# Altium schematic sheet MB-01-TopLevel.SchDoc
size A3
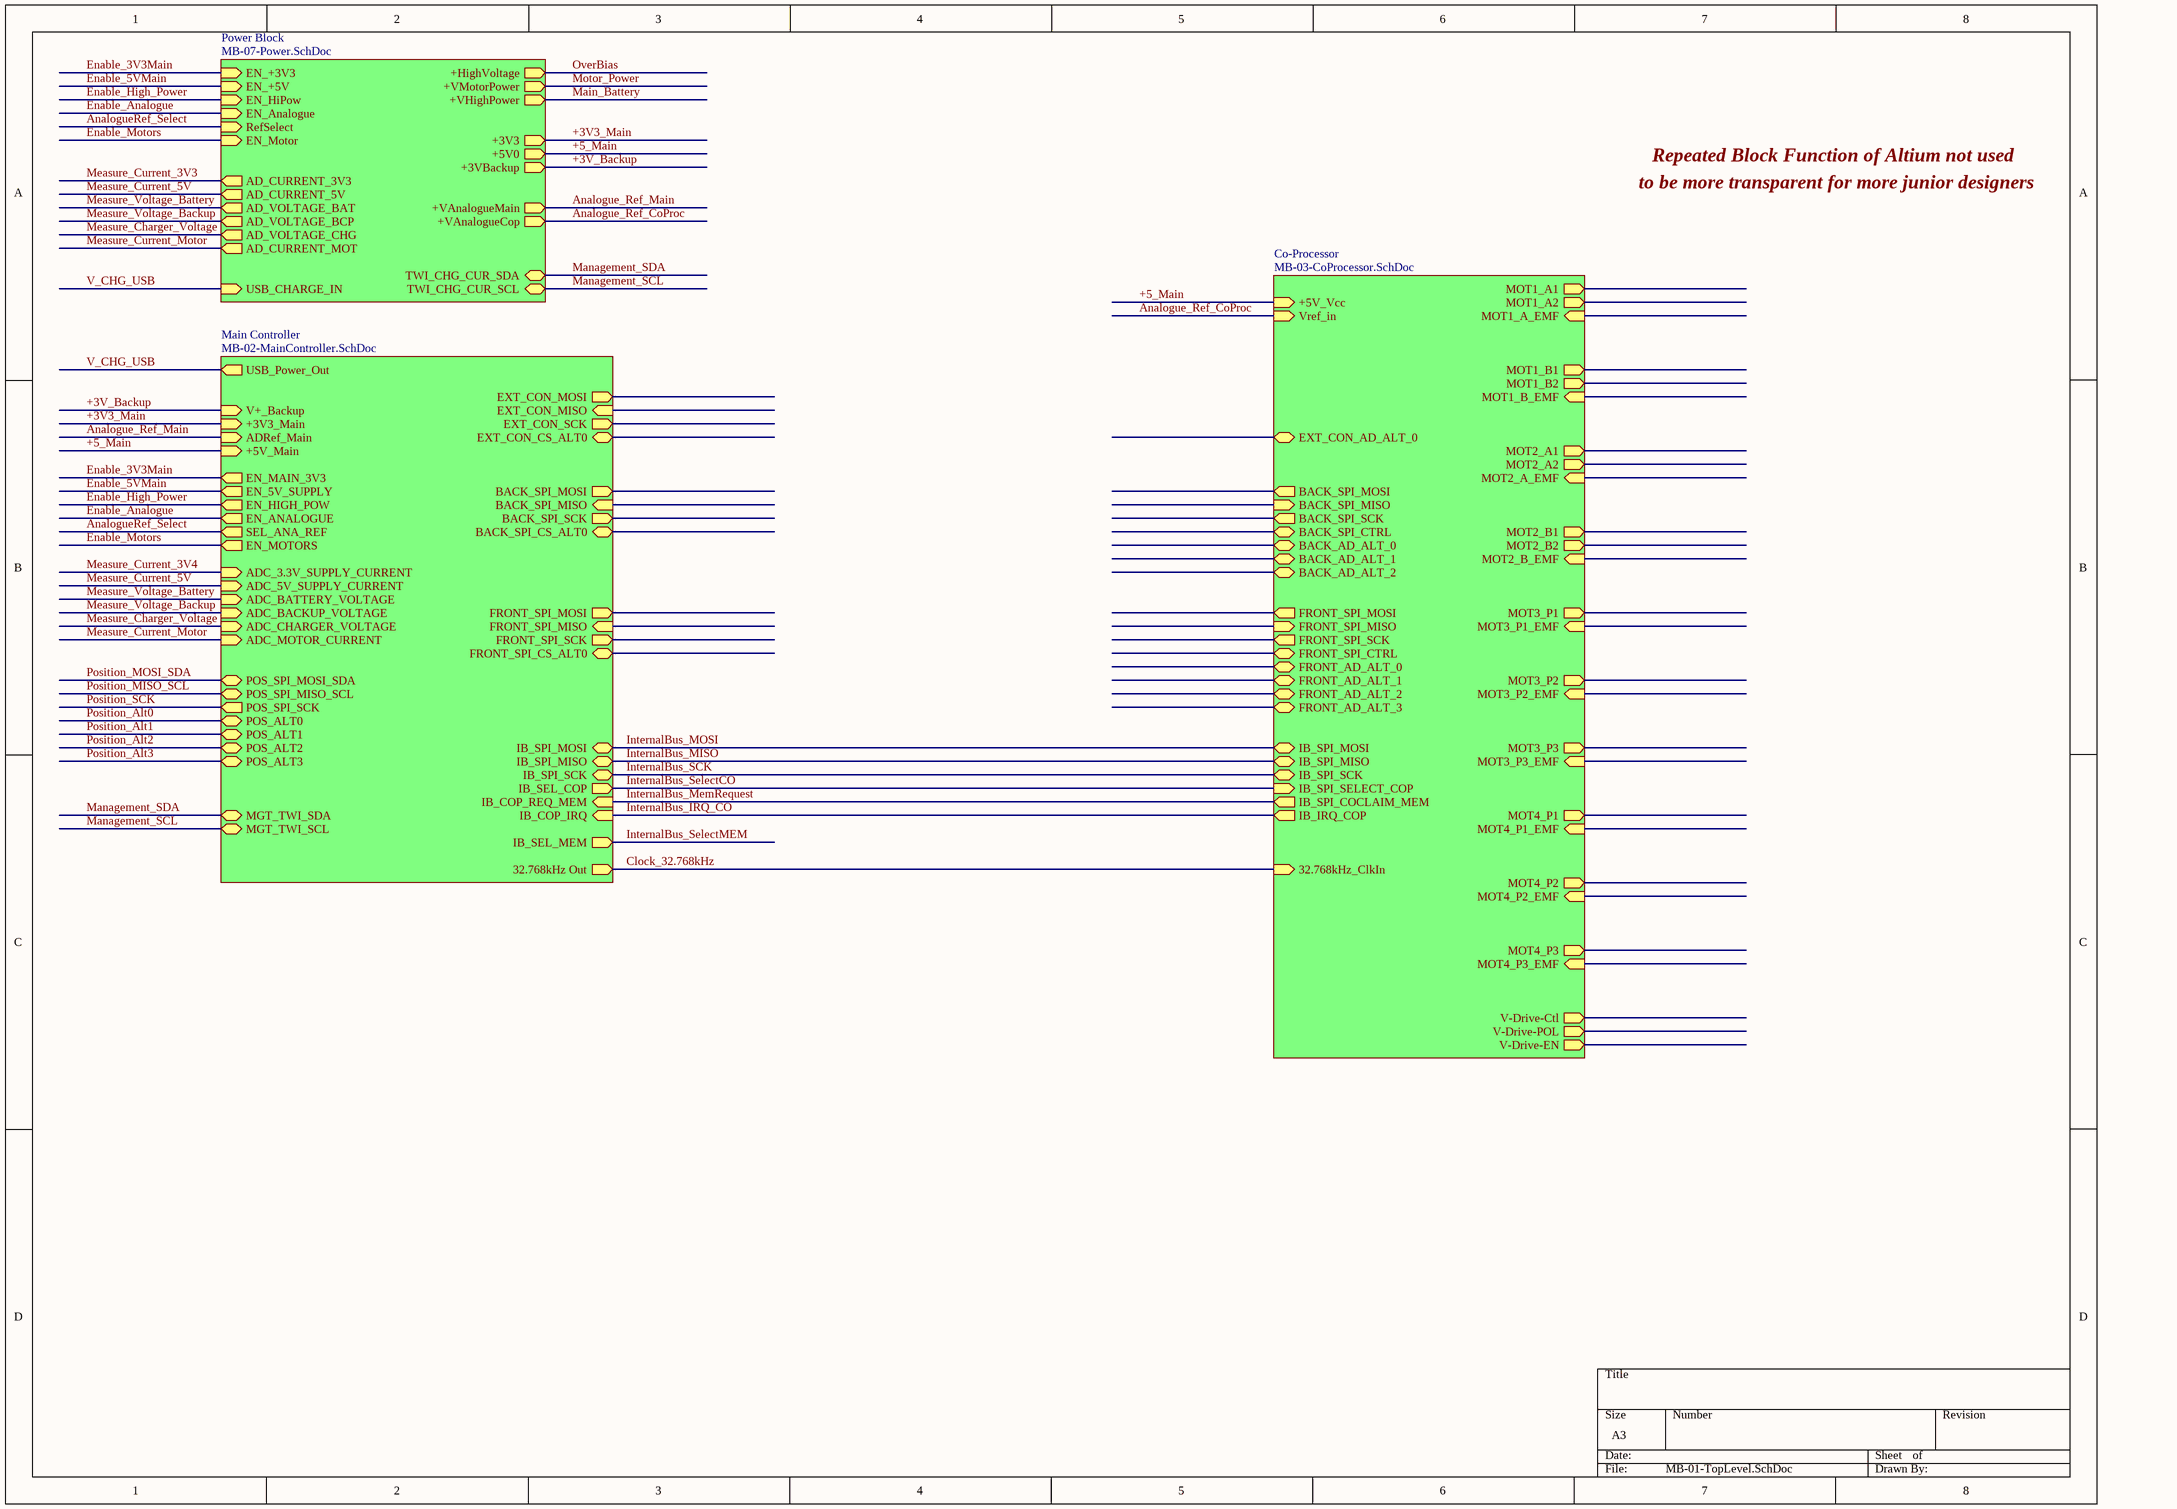
[diagram p0: MB-01-TopLevel.SchDoc]

## Sub-sheets
Co-Processor = MB-03-CoProcessor.SchDoc: BACK_AD_ALT_1 (bidir), EXT_CON_AD_ALT_0 (bidir), BACK_AD_ALT_2 (bidir), BACK_AD_ALT_0 (bidir), FRONT_AD_ALT_3 (bidir), FRONT_AD_ALT_2 (bidir), FRONT_AD_ALT_1 (bidir), FRONT_AD_ALT_0 (bidir), BACK_SPI_SCK (out), BACK_SPI_MISO (in), BACK_SPI_MOSI (out), BACK_SPI_CTRL (bidir), FRONT_SPI_CTRL (bidir), FRONT_SPI_SCK (out), FRONT_SPI_MISO (in), FRONT_SPI_MOSI (out), +5V_Vcc (in), Vref_in (in), V-Drive-POL (out), V-Drive-EN (out), V-Drive-Ctl (out), MOT4_P3 (out), MOT4_P2 (out), MOT4_P1 (out), MOT3_P3 (out), MOT3_P2 (out), MOT3_P1 (out), MOT2_A1 (out), MOT1_B2 (out), MOT2_B2 (out), MOT2_B1 (out), MOT2_A2 (out), MOT1_B1 (out), MOT1_A2 (out), MOT1_A1 (out), 32.768kHz_ClkIn (in), IB_SPI_COCLAIM_MEM (out), IB_IRQ_COP (out), IB_SPI_SCK (bidir), IB_SPI_SELECT_COP (in), IB_SPI_MISO (bidir), IB_SPI_MOSI (bidir), MOT1_B_EMF (in), MOT1_A_EMF (in), MOT2_B_EMF (in), MOT3_P1_EMF (in), MOT2_A_EMF (in), MOT3_P2_EMF (in), MOT3_P3_EMF (in), MOT4_P1_EMF (in), MOT4_P2_EMF (in), MOT4_P3_EMF (in)
Main Controller = MB-02-MainController.SchDoc: ADC_BATTERY_VOLTAGE (in), BACK_SPI_SCK (out), USB_Power_Out (out), V+_Backup (in), +3V3_Main (in), ADRef_Main (in), ADC_MOTOR_CURRENT (in), +5V_Main (in), EXT_CON_SCK (out), EXT_CON_CS_ALT0 (bidir), EXT_CON_MOSI (out), EXT_CON_MISO (in), BACK_SPI_CS_ALT0 (bidir), BACK_SPI_MISO (in), BACK_SPI_MOSI (out), 32.768kHz Out (out), FRONT_SPI_SCK (out), FRONT_SPI_CS_ALT0 (bidir), FRONT_SPI_MOSI (out), FRONT_SPI_MISO (in), IB_COP_REQ_MEM (in), IB_SEL_MEM (out), IB_COP_IRQ (in), IB_SEL_COP (out), IB_SPI_MISO (bidir), IB_SPI_MOSI (bidir), IB_SPI_SCK (bidir), POS_ALT2 (bidir), POS_ALT3 (bidir), POS_ALT0 (bidir), POS_ALT1 (bidir), SEL_ANA_REF (out), EN_5V_SUPPLY (out), POS_SPI_MISO_SCL (bidir), POS_SPI_SCK (out), EN_HIGH_POW (out), POS_SPI_MOSI_SDA (bidir), EN_ANALOGUE (out), EN_MOTORS (out), ADC_3.3V_SUPPLY_CURRENT (in), ADC_BACKUP_VOLTAGE (in), ADC_CHARGER_VOLTAGE (in), EN_MAIN_3V3 (out), ADC_5V_SUPPLY_CURRENT (in), MGT_TWI_SDA (bidir), MGT_TWI_SCL (bidir)
Power Block = MB-07-Power.SchDoc: +VHighPower (out), EN_Motor (in), EN_Analogue (in), +VMotorPower (out), +3V3 (out), RefSelect (in), +5V0 (out), EN_+5V (in), +VAnalogueCop (out), +VAnalogueMain (out), +HighVoltage (out), EN_+3V3 (in), EN_HiPow (in), AD_VOLTAGE_BCP (out), USB_CHARGE_IN (in), AD_CURRENT_3V3 (out), AD_CURRENT_MOT (out), AD_CURRENT_5V (out), AD_VOLTAGE_BAT (out), AD_VOLTAGE_CHG (out), TWI_CHG_CUR_SCL (bidir), TWI_CHG_CUR_SDA (bidir), +3VBackup (out)

## Nets
+3V3_Main: sheet Main Controller/+3V3_Main, sheet Power Block/+3V3
+3V_Backup: sheet Main Controller/V+_Backup, sheet Power Block/+3VBackup
+5_Main: sheet Main Controller/+5V_Main, sheet Co-Processor/+5V_Vcc, sheet Power Block/+5V0
Analogue_Ref_CoProc: sheet Co-Processor/Vref_in, sheet Power Block/+VAnalogueCop
Analogue_Ref_Main: sheet Main Controller/ADRef_Main, sheet Power Block/+VAnalogueMain
AnalogueRef_Select: sheet Main Controller/SEL_ANA_REF, sheet Power Block/RefSelect
Clock_32.768kHz: sheet Main Controller/32.768kHz Out, sheet Co-Processor/32.768kHz_ClkIn
Enable_3V3Main: sheet Main Controller/EN_MAIN_3V3, sheet Power Block/EN_+3V3
Enable_5VMain: sheet Main Controller/EN_5V_SUPPLY, sheet Power Block/EN_+5V
Enable_Analogue: sheet Main Controller/EN_ANALOGUE, sheet Power Block/EN_Analogue
Enable_High_Power: sheet Main Controller/EN_HIGH_POW, sheet Power Block/EN_HiPow
Enable_Motors: sheet Main Controller/EN_MOTORS, sheet Power Block/EN_Motor
InternalBus_IRQ_CO: sheet Main Controller/IB_COP_IRQ, sheet Co-Processor/IB_IRQ_COP
InternalBus_MemRequest: sheet Main Controller/IB_COP_REQ_MEM, sheet Co-Processor/IB_SPI_COCLAIM_MEM
InternalBus_MISO: sheet Main Controller/IB_SPI_MISO, sheet Co-Processor/IB_SPI_MISO
InternalBus_MOSI: sheet Main Controller/IB_SPI_MOSI, sheet Co-Processor/IB_SPI_MOSI
InternalBus_SCK: sheet Main Controller/IB_SPI_SCK, sheet Co-Processor/IB_SPI_SCK
InternalBus_SelectCO: sheet Main Controller/IB_SEL_COP, sheet Co-Processor/IB_SPI_SELECT_COP
InternalBus_SelectMEM: sheet Main Controller/IB_SEL_MEM
Main_Battery: sheet Power Block/+VHighPower
Management_SCL: sheet Main Controller/MGT_TWI_SCL, sheet Power Block/TWI_CHG_CUR_SCL
Management_SDA: sheet Main Controller/MGT_TWI_SDA, sheet Power Block/TWI_CHG_CUR_SDA
Measure_Charger_Voltage: sheet Main Controller/ADC_CHARGER_VOLTAGE, sheet Power Block/AD_VOLTAGE_CHG
Measure_Current_3V3: sheet Power Block/AD_CURRENT_3V3
Measure_Current_3V4: sheet Main Controller/ADC_3.3V_SUPPLY_CURRENT
Measure_Current_5V: sheet Main Controller/ADC_5V_SUPPLY_CURRENT, sheet Power Block/AD_CURRENT_5V
Measure_Current_Motor: sheet Main Controller/ADC_MOTOR_CURRENT, sheet Power Block/AD_CURRENT_MOT
Measure_Voltage_Backup: sheet Main Controller/ADC_BACKUP_VOLTAGE, sheet Power Block/AD_VOLTAGE_BCP
Measure_Voltage_Battery: sheet Main Controller/ADC_BATTERY_VOLTAGE, sheet Power Block/AD_VOLTAGE_BAT
Motor_Power: sheet Power Block/+VMotorPower
OverBias: sheet Power Block/+HighVoltage
Position_Alt0: sheet Main Controller/POS_ALT0
Position_Alt1: sheet Main Controller/POS_ALT1
Position_Alt2: sheet Main Controller/POS_ALT2
Position_Alt3: sheet Main Controller/POS_ALT3
Position_MISO_SCL: sheet Main Controller/POS_SPI_MISO_SCL
Position_MOSI_SDA: sheet Main Controller/POS_SPI_MOSI_SDA
Position_SCK: sheet Main Controller/POS_SPI_SCK
V_CHG_USB: sheet Main Controller/USB_Power_Out, sheet Power Block/USB_CHARGE_IN

## Notes on the sheet
- Repeated Block Function of Altium not used
- to be more transparent for more junior designers